# EAGLE design DeepSpace (EAGLE 9.6.2)

## Sheet 1 of 2
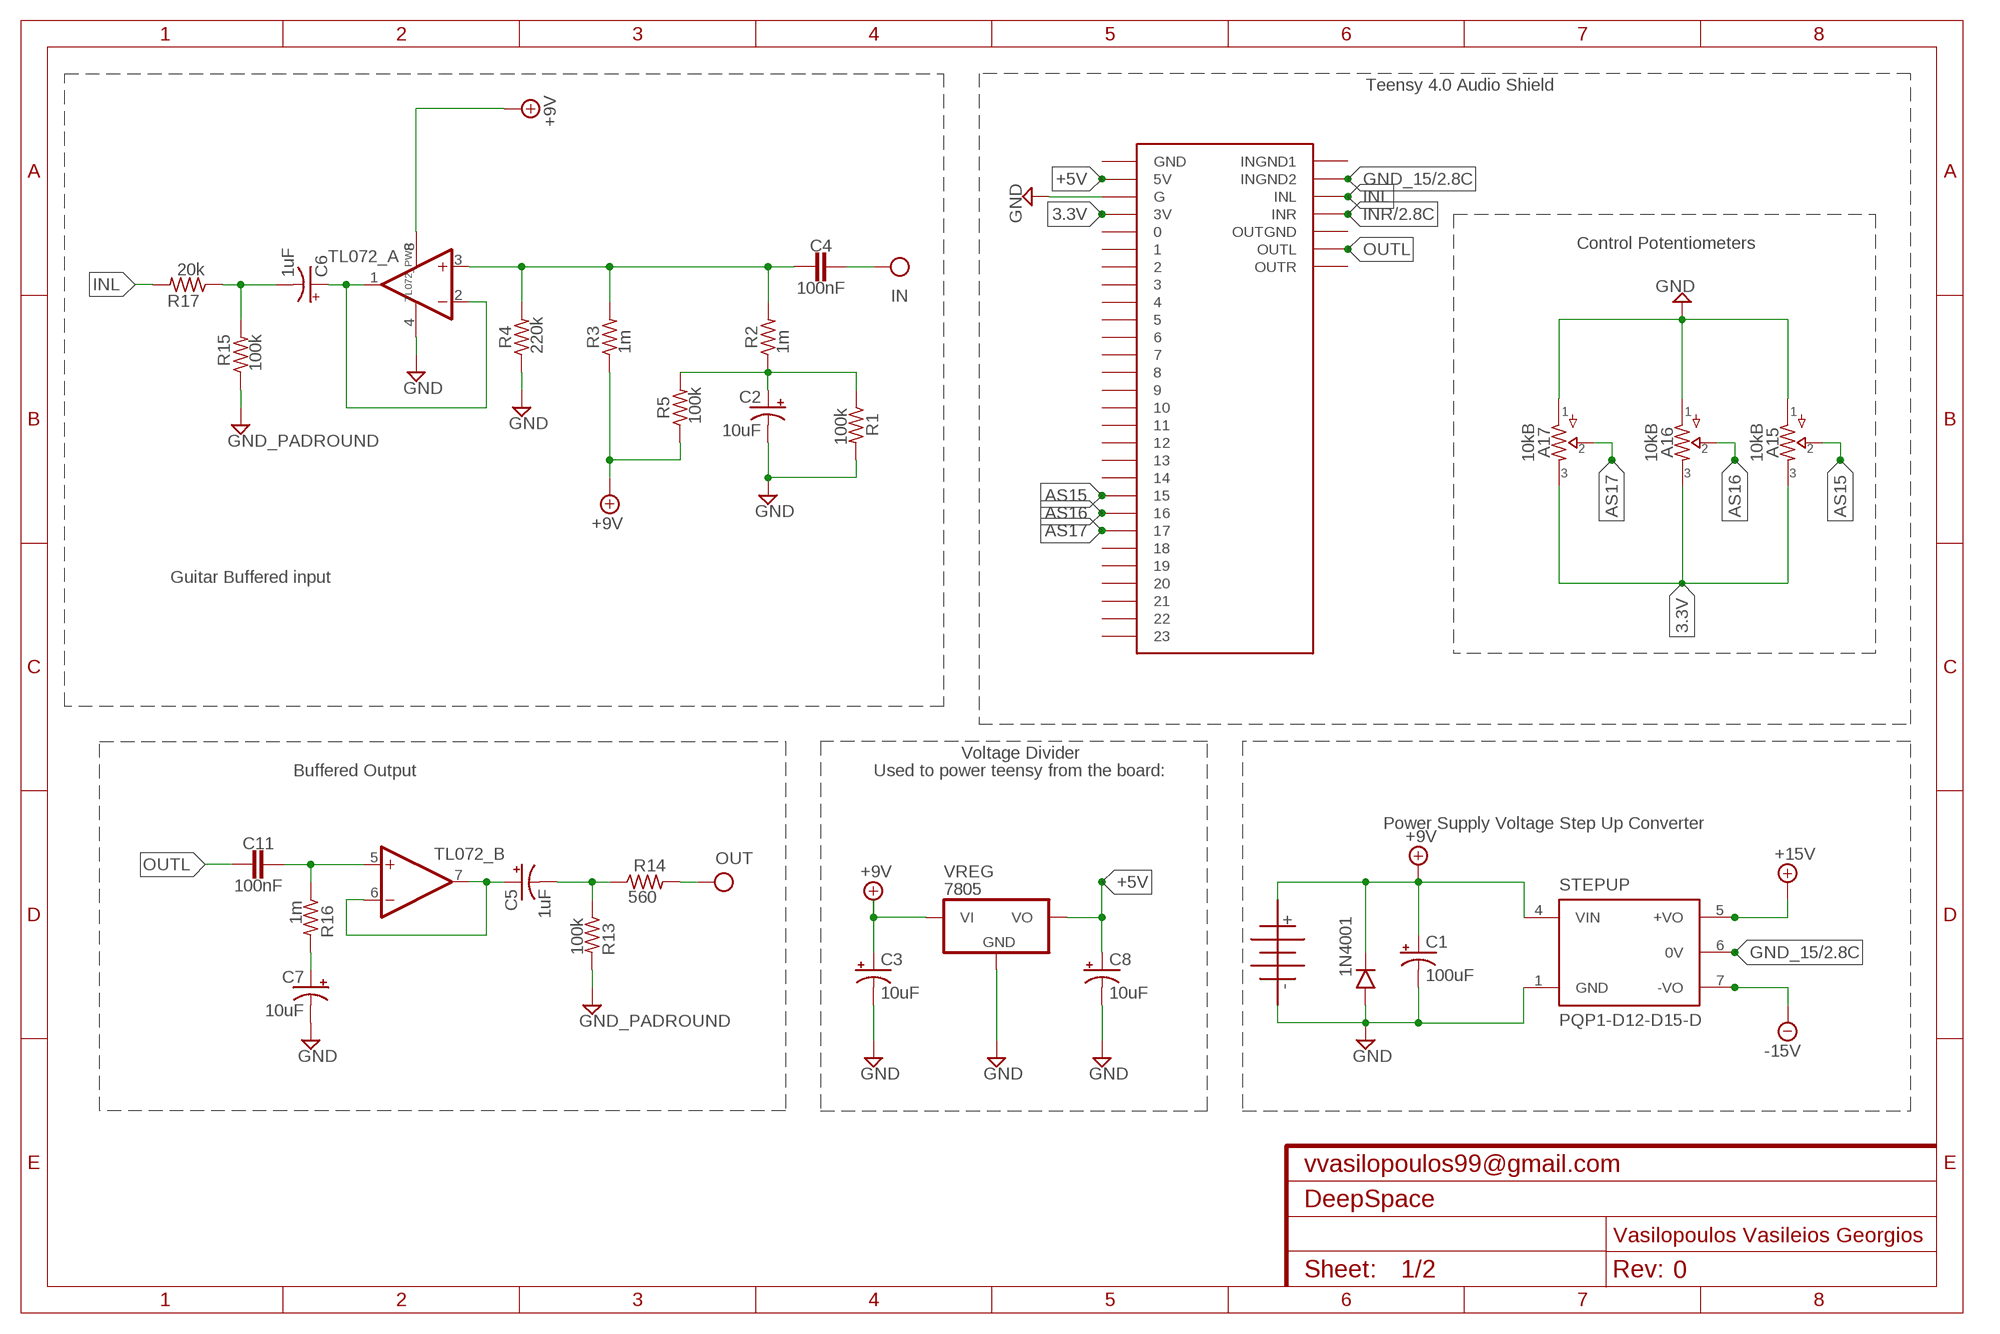
[diagram p0: schematic, sheet 1]
FRAME1 (FRAME-A4L): CNAME: vvasilopoulos99@gmail.com; CREVISION: 0; DESIGNER: Vasilopoulos Vasileios Georgios; REV: 0

### Parts
1N4001  DO41.3  [DO41-3]
A15  10kB  16MM.1  [16MM_B.MOUNT]
A16  10kB  16MM.1  [16MM_B.MOUNT]
A17  10kB  16MM.1  [16MM_B.MOUNT]
AS1  teensy audio shield  AUDIOSHIELD  [AUDIOSHIELD]
C1  100uF  0631  [063_025]
C2  10uF  0501  [050_020_1]
C3  10uF  0501  [050_020_1]
C4  100nF  CAP.2  [0.2".SML]
C5  1uF  0501  [050_020_1]
C6  1uF  0501  [050_020_1]
C7  10uF  0501  [050_020_1]
C8  10uF  0501  [050_020_1]
C11  100nF  CAP.2  [0.2".SML]
GI  GND_PADROUND  [ROUND]
GO  GND_PADROUND  [ROUND]
OUT  OUT  [SQUARE]
PWR  BATTERYBAT2  [BATTERY2]
R1  100k  RESISTORS.3B  [R0207/3]
R2  1m  RESISTORS.3B  [R0207/3]
R3  1m  RESISTORS.3B  [R0207/3]
R4  220k  RESISTORS.3B  [R0207/3]
R5  100k  RESISTORS.3B  [R0207/3]
R13  100k  RESISTORS.3B  [R0207/3]
R14  560  RESISTORS.3B  [R0207/3]
R15  100k  RESISTORS.3B  [R0207/3]
R16  1m  RESISTORS.3B  [R0207/3]
R17  20k  RESISTORS.3B  [R0207/3]
STEPUP  PQP1-D12-D15-D  [CONV_PQP1-D12-D15-D]
TL072  DUALTH  [DIL08]
VREG  7805  [TO92-]
ΙΝ  IN  [SQUARE]

### Nets
3.3V: A15.3 A16.3 A17.3 AS1.3V
10UF: C2.+ R1.1 R2.1 R5.2
+5V: AS1.5V C8.+ VREG.3(VO)
+9V: 1N4001.C C1.+ C3.+ PWR.P$1 R3.1 R5.1 STEPUP.4(VIN) TL072.8(_PWR:V+) VREG.1(VI)
+15V: STEPUP.5(+VO) ; also sheet 2
-VC: STEPUP.7(-VO) ; supply symbol labelled -15V ; also sheet 2
AS15: A15.2 AS1.15
AS16: A16.2 AS1.16
AS17: A17.2 AS1.17
GND: 1N4001.A A15.1 A16.1 A17.1 AS1.G C1.- C2.- C3.- C7.- C8.- GI.1(GND) GO.1(GND) PWR.P$2 R1.2 R4.1 R13.2 R15.1 STEPUP.1(GND) TL072.4(_PWR:V-) VREG.2(GND)
GND_15: AS1.INGND2 STEPUP.6(0V) ; also sheet 2
IN: C4.1 ΙΝ.1(IN)
INL: AS1.INL R17.2
INR: AS1.INR ; also sheet 2
N$5: C7.+ R16.2
N$9: C6.+ TL072.1(_A:OUT) TL072.2(_A:-IN)
N$10: C6.- R15.2 R17.1
N$12: C4.2 R2.2 R3.2 R4.2 TL072.3(_A:+IN)
N$14: C11.1 R16.1 TL072.5(_B:+IN)
N$15: C5.+ TL072.6(_B:-IN) TL072.7(_B:OUT)
N$23: C5.- R13.1 R14.1
OUT: OUT.1(OUT) R14.2
OUTL: AS1.OUTL C11.2
Unconnected: AS1.0 AS1.1 AS1.2 AS1.3 AS1.4 AS1.5 AS1.6 AS1.7 AS1.8 AS1.9 AS1.10 AS1.11 AS1.12 AS1.13 AS1.14 AS1.18 AS1.19 AS1.20 AS1.21 AS1.22 AS1.23 AS1.GND AS1.INGND1 AS1.OUTGND AS1.OUTR

### Notes on the sheet
- Teensy 4.0 Audio Shield
- Control Potentiometers
- Guitar Buffered input
- Voltage Divider
- Buffered Output | Used to power teensy from the board:
- Power Supply Voltage Step Up Converter

## Sheet 2 of 2
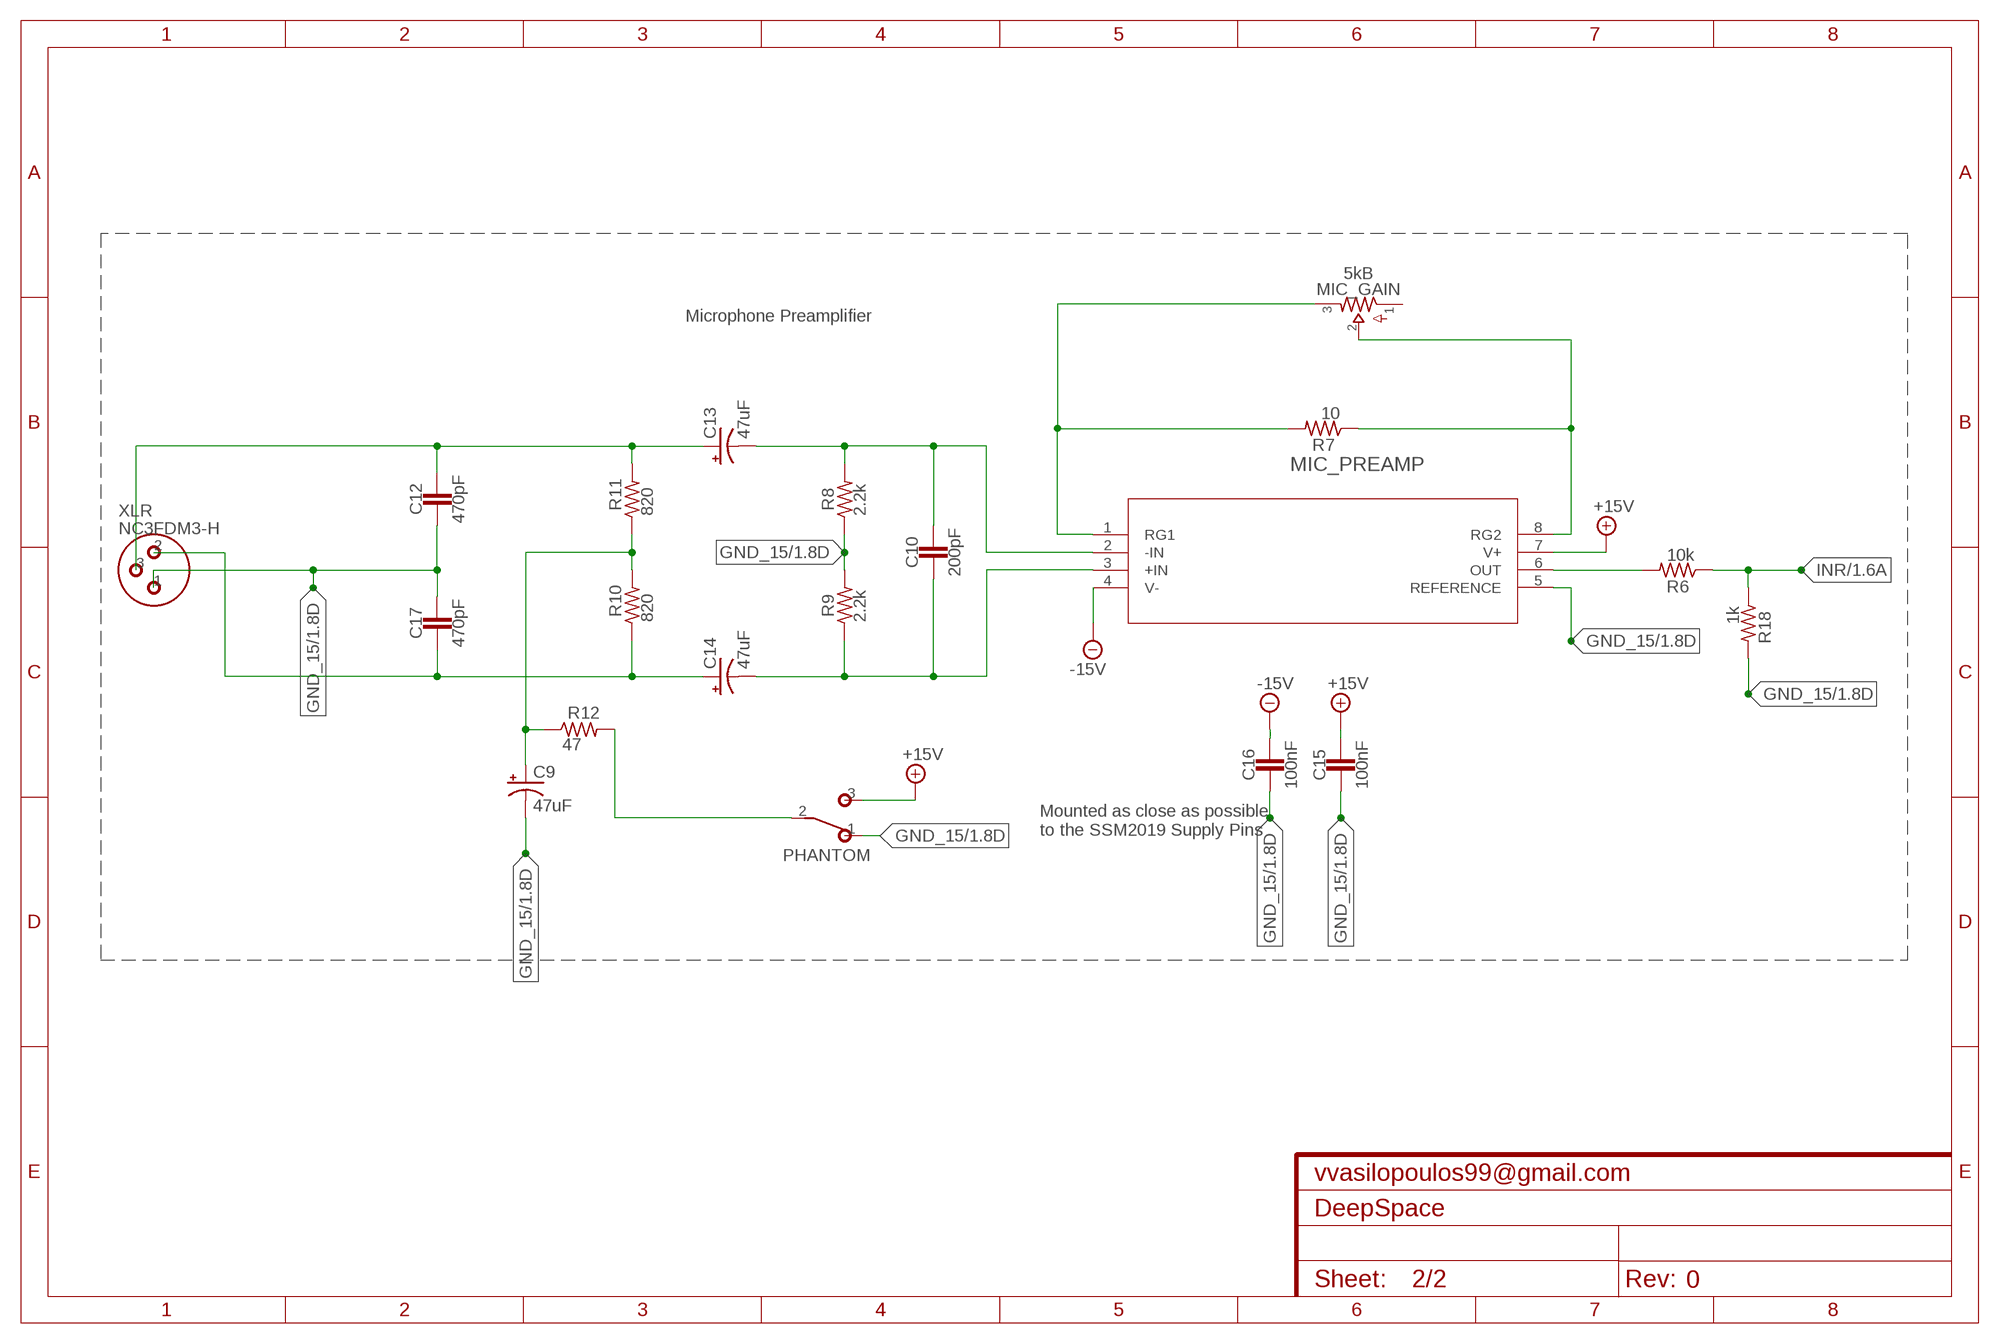
[diagram p1: schematic, sheet 2]
FRAME2 (FRAME-A4L): CNAME: vvasilopoulos99@gmail.com; CREVISION: 0

### Parts
C9  47uF  0501  [050_020_1]
C10  200pF  CAP.2  [0.2".SML]
C12  470pF  CAP.2  [0.2".SML]
C13  47uF  0631  [063_025]
C14  47uF  0631  [063_025]
C15  100nF  CAP.2  [0.2".SML]
C16  100nF  CAP.2  [0.2".SML]
C17  470pF  CAP.2  [0.2".SML]
MIC_GAIN  5kB  TRIMMER  [TRIM1]
MIC_PREAMP  SSM2019BNZ  [N_8_ADI]
PHANTOM  SPDTPADS  [SPDT]
R6  10k  RESISTORS.3B  [R0207/3]
R7  10  RESISTORS.3B  [R0207/3]
R8  2.2k  RESISTORS.3B  [R0207/3]
R9  2.2k  RESISTORS.3B  [R0207/3]
R10  820  RESISTORS.3B  [R0207/3]
R11  820  RESISTORS.3B  [R0207/3]
R12  47  RESISTORS.3B  [R0207/3]
R18  1k  RESISTORS.3B  [R0207/3]
XLR  NC3FDM3-H  XLR  [XLR_PADS]

### Nets
+15V: C15.1 MIC_PREAMP.7(V+) PHANTOM.3(S) ; also sheet 1
-VC: C16.1 MIC_PREAMP.4(V-) ; supply symbol labelled -15V ; also sheet 1
GND_15: C9.- C12.2 C15.2 C16.2 C17.1 MIC_PREAMP.5(REFERENCE) PHANTOM.1(O) R8.1 R9.2 R18.2 XLR.1 ; also sheet 1
INR: R6.1 R18.1 ; also sheet 1
N$1: MIC_GAIN.3 MIC_PREAMP.1(RG1) R7.2
N$2: MIC_GAIN.2 MIC_PREAMP.8(RG2) R7.1
N$3: C10.1 C13.- MIC_PREAMP.2(-IN) R8.2
N$4: C10.2 C14.- MIC_PREAMP.3(+IN) R9.1
N$7: C9.+ R10.2 R11.1 R12.1
N$8: PHANTOM.2(P) R12.2
N$20: MIC_PREAMP.6(OUT) R6.2
XLR2: C12.1 C13.+ R11.2 XLR.3
XLR2-SSM3: C14.+ C17.2 R10.1 XLR.2
Unconnected: MIC_GAIN.1

### Notes on the sheet
- Microphone Preamplifier
- Mounted as close as possible 
  to the SSM2019 Supply Pins

## Library data of the parts
1N4001 = diodes:DO41: DO-41 Package Diodes: 1N4001 - 1N40019 Zener Diodes: 1N4728 - 1N4764
A15-A17 = potentiometers:16MM: 16mm Poteniometers
AS1 = Teensy_Audioshield_no_holes:AUDIOSHIELD: Teensy 3 Audioshield by PJRC.COM; MF: ADAFRUIT; MPN: 4384; OC_NEWARK: 50AH1487
C1 C13 C14 = caps-elec:063: 33 - 220uF Xicon values at Mouser.com 10V: 220uF; 16V: 100uF; 25V: 100uF; 50V: 33uF
C2 C3 C5-C9 = caps-elec:050: 0.22 - 100uF Xicon values at Mouser.com: 10V: 10 - 100uF; 16V: 2.2 - 47uF; 25V: 0.47 - 47uF; 50V: 0.22 - 22uF
C4 C10-C12 C15-C17 = caps-film:CAP: For Ceramic, Film, MLCC caps
GI GO = supply pins:GND_PAD: Ground use this to hook up ground connections throughout a schematic instead of running wire automatically labels the net "GND"
MIC_GAIN = potentiometers:TRIMMER: Trimpots
MIC_PREAMP = Ssm2019:SSM2019BNZ; BUILT_BY: EMA_UL_Team; MANUFACTURER_PART_NUMBER: SSM2019BNZ; MF: ANALOG DEVICES; MPN: SSM2019BRNZ; OC_NEWARK: 94T5936; SOURCELIBRARY: Analog_2012-01-01_9; VENDOR: Analog Devices Inc
OUT = supply pins:OUT: Output obsolete: use Mark instead and label net output label without circuit board terminal/pad commonly used as output label on 2nd lug of a potentiometer
PHANTOM = switches:SPDT: TOGGLE SWITCH Marquardt
PWR = jacks:BATTERY
R1-R18 = resistors:RESISTORS
STEPUP = PQP1-D12-D15-D:PQP1-D12-D15-D: DC-DC CONVERTER; MANUFACTURER: CUI Inc.; MAXIMUM_PACKAGE_HEIGHT: 9.50mm; OC_NEWARK: unknown; PARTREV: 1.0; STANDARD: Manufacturer Recommendations
TL072 = integrated circuits:DUAL: OP AMP
VREG = regulators:7805
XLR = jacks:XLR
ΙΝ = supply pins:IN: Input obsolete: use Mark instead and label net schematic input label without circuit board terminal/pad labels net "IN" provided as complement to OUT (rarely used)

## Net classes
0 default: width 0.254 mm, drill 0.508 mm, clearance 0.254 mm

## Board
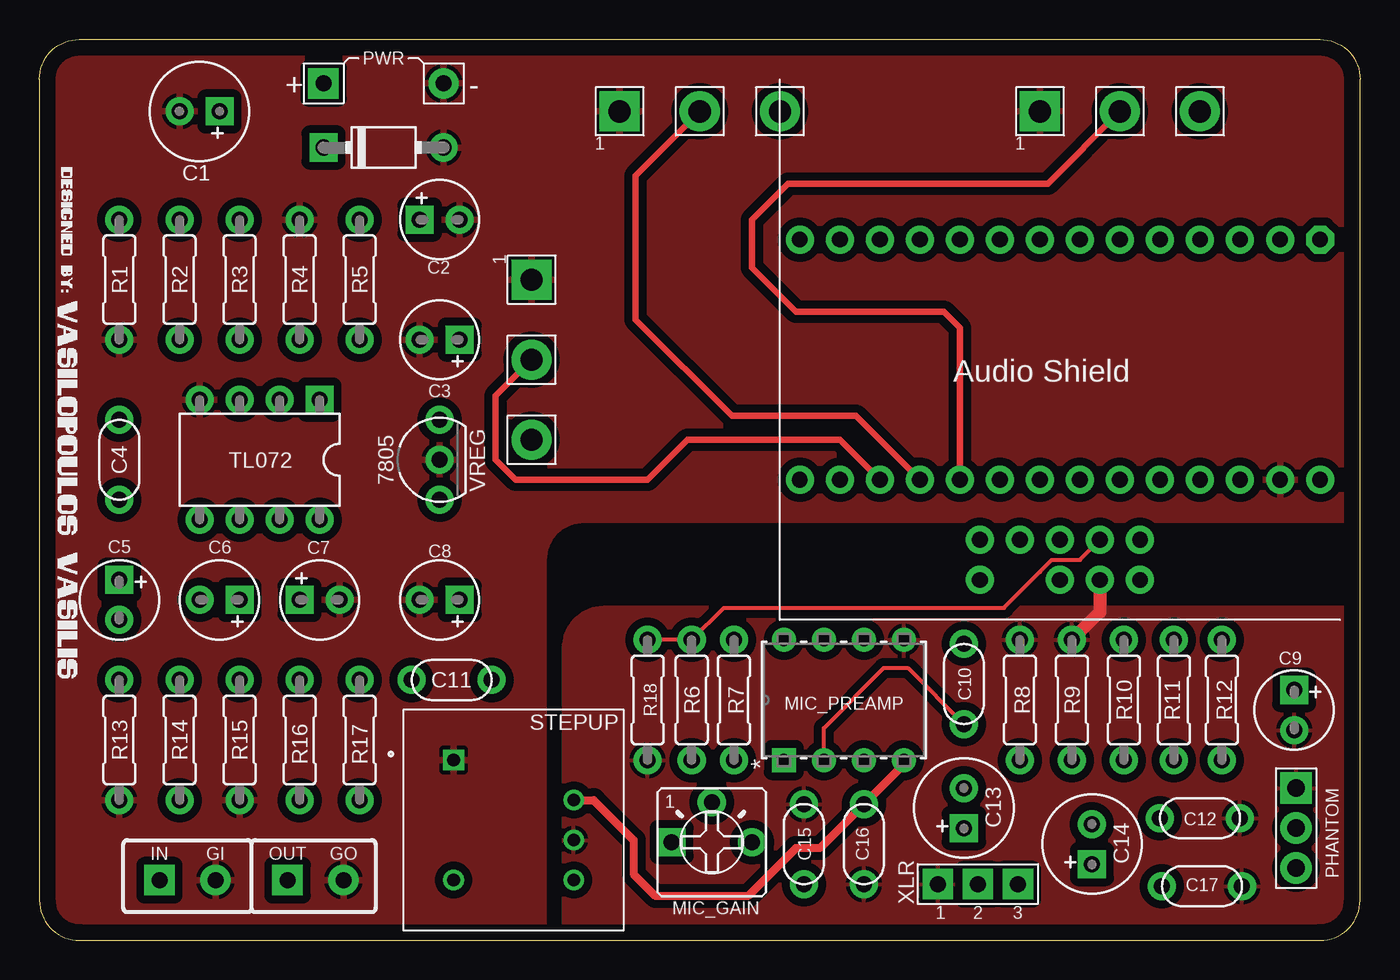
[diagram p2: board, top side]
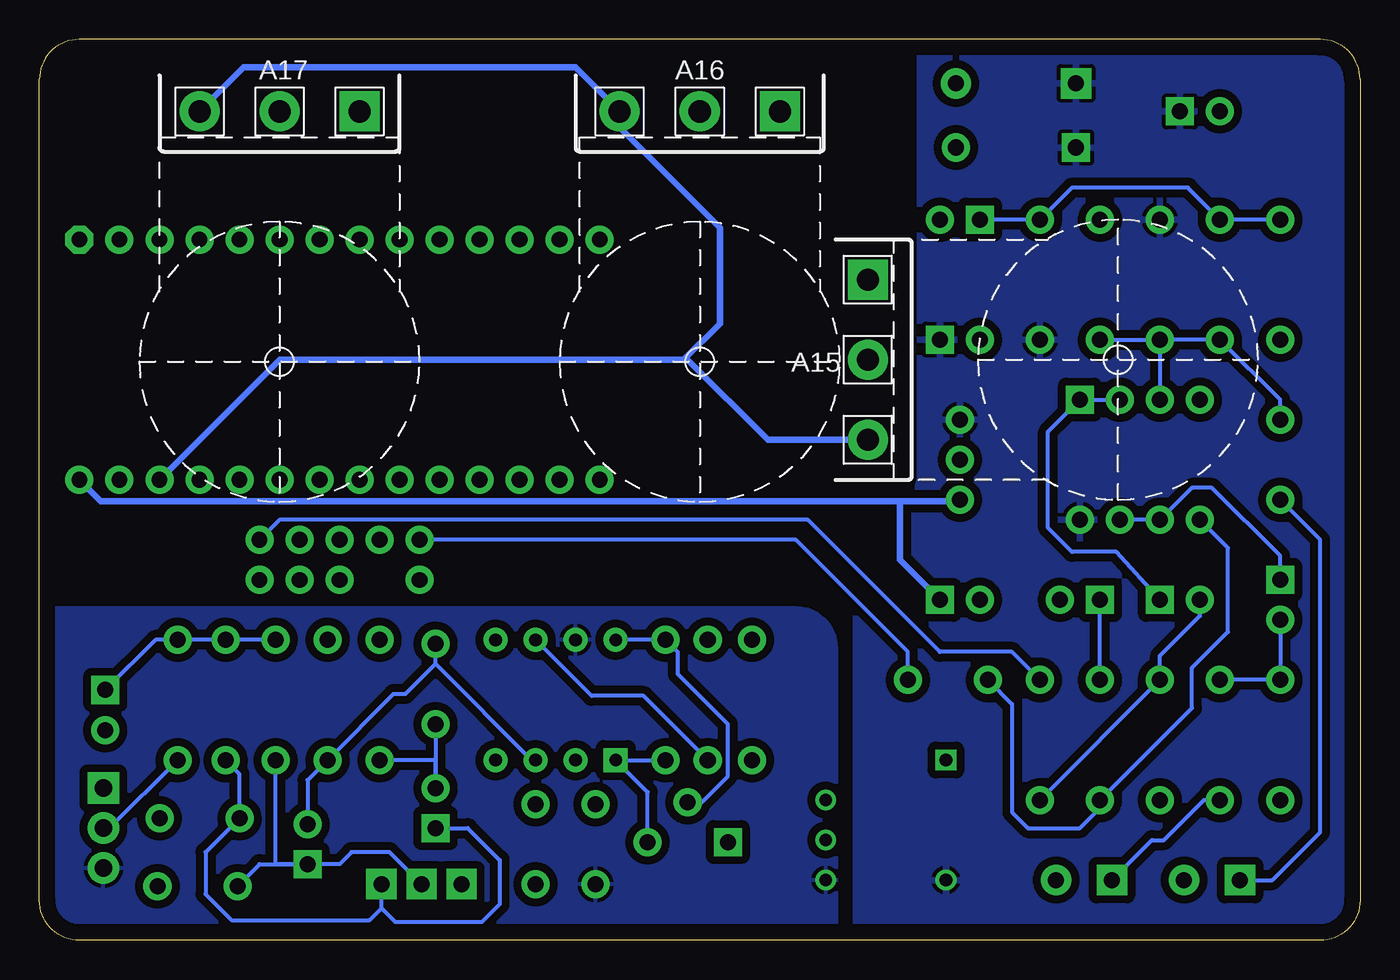
[diagram p3: board, bottom side, seen from below]

Size 83.82 x 57.15 mm. Coordinates in mm from the lower left corner, seen from the top.
Outline: 0,2.54 arc90 2.54,0 81.28,0 arc90 83.82,2.54 83.82,54.61 arc90 81.28,57.15 2.54,57.15 arc90 0,54.61 0,2.54
Copper layers (1*16): Top 0.035mm / dielectric 1.5mm / Bottom 0.035mm
Design rules "default *": minimum track width 10mil, minimum drill 0.35mm, track to track 20mil, track to pad 10mil, pad to pad 10mil, via to via 10mil, smd to smd 6mil, copper to edge 40mil, drill to drill 6mil, minimum pad ring 10mil, minimum via ring 8mil, stop-mask expansion 4mil, vias tented up to drill 0mil, thermal gap 10mil

### Footprints (pad centres in the part's own frame; a part is rotated, then mirrored left to right if it is on the bottom)
DO41-3 = drill 1.016 pad 1.778: A 3.81,0 | drill 1.016 pad 1.778 square: C -3.81,0
16MM_B.MOUNT = drill 1.4 pad 2.54 square: 1 5.08,0 | drill 1.4 pad 2.54: 2 0,0; 3 -5.08,0
AUDIOSHIELD = drill 1 pad 1.778: 0 -13.97,-5.08; 1 -11.43,-5.08; 2 -8.89,-5.08; 3 -6.35,-5.08; 3V -11.43,10.16; 4 -3.81,-5.08; 5 -1.27,-5.08; 5V -16.51,10.16; 6 1.27,-5.08; 7 3.81,-5.08; 8 6.35,-5.08; 9 8.89,-5.08; 10 11.43,-5.08; 11 13.97,-5.08; 12 16.51,-5.08; 13 16.51,10.16; 14 13.97,10.16; 15 11.43,10.16; 16 8.89,10.16; 17 6.35,10.16; 18 3.81,10.16; 19 1.27,10.16; 20 -1.27,10.16; 21 -3.81,10.16; 22 -6.35,10.16; 23 -8.89,10.16; G -13.97,10.16; INGND1 -5.08,16.51; INGND2 -2.54,16.51; INL -5.08,13.97; INR -2.54,13.97; OUTGND 2.54,13.97; OUTL 5.08,13.97; OUTR 0,13.97; UNUSED1 0,16.51; UNUSED2 5.08,16.51 | drill 1 pad 1.778 octagon: GND -16.51,-5.08
063_025 = drill 1.016 pad 1.778 square: + -1.27,0 | drill 1.016 pad 1.778: - 1.27,0
050_020_1 = drill 1.016 pad 1.778 square: + -1.27,0 | drill 1.016 pad 1.778: - 1.27,0
0.2".SML = drill 1.016 pad 1.778: 1 -2.54,0; 2 2.54,0
ROUND = drill 1.016 pad 1.93: 1 0,0
TRIM1 = drill 1.016 pad 1.778 square: 1 -2.54,0 | drill 1.016 pad 1.778: 2 0,2.54; 3 2.54,0
N_8_ADI = drill 0.813 pad 1.524 square: 1 0,0 | drill 0.813 pad 1.524: 2 0,-2.54; 3 0,-5.08; 4 0,-7.62; 5 7.62,-7.62; 6 7.62,-5.08; 7 7.62,-2.54; 8 7.62,0
SQUARE = drill 1.016 pad 1.93 square: 1 0,0
SPDT = drill 1.118 pad 2 square: 1 -2.54,0 | drill 1.118 pad 2: 2 0,0; 3 2.54,0
BATTERY2 = drill 1.016 pad 1.93 square: P$1 -3.81,0 | drill 1.016 pad 1.93: P$2 3.81,0
R0207/3 = drill 1.016 pad 1.778: 1 -3.81,0; 2 3.81,0
CONV_PQP1-D12-D15-D = drill 0.8 square: 1 -3.81,3.81 | drill 0.8: 4 -3.81,-3.81; 5 3.81,-3.81; 6 3.81,-1.27; 7 3.81,1.27
DIL08 = drill 1.016 pad 1.778 square: 1 -3.81,-3.81 | drill 1.016 pad 1.778: 2 -1.27,-3.81; 3 1.27,-3.81; 4 3.81,-3.81; 5 3.81,3.81; 6 1.27,3.81; 7 -1.27,3.81; 8 -3.81,3.81
TO92- = drill 1.016 pad 1.778: 1 -2.54,0; 2 0,0; 3 2.54,0
XLR_PADS = drill 1.016 pad 1.93 square: 1 -2.54,0; 2 0,0; 3 2.54,0

### Placement (x,y rotation side)
1N4001  21.84,50.29 0 top
A15  31.24,36.83 90 top
A16  41.91,52.58 180 top
A17  68.58,52.58 180 top
AS1  64.77,39.37 180 top
C1  10.16,52.58 180 top
C2  25.4,45.72 0 top
C3  25.4,38.1 180 top
C4  5.08,30.48 90 top
C5  5.08,21.59 270 top
C6  11.43,21.59 180 top
C7  17.78,21.59 0 top
C8  25.4,21.59 180 top
C9  79.63,14.61 270 top
C10  58.67,16.26 90 top
C11  26.16,16.51 0 top
C12  73.66,7.75 0 top
C13  58.67,8.38 90 top
C14  66.8,6.1 90 top
C15  48.51,6.1 90 top
C16  52.32,6.1 270 top
C17  73.79,3.43 180 top
GI  11.18,3.81 0 top
GO  19.3,3.81 0 top
MIC_GAIN  42.67,6.22 0 top
MIC_PREAMP  47.24,11.43 90 top
OUT  15.75,3.81 0 top
PHANTOM  79.76,7.11 270 top
PWR  21.84,54.36 0 top
R1  5.08,41.91 270 top
R2  8.89,41.91 270 top
R3  12.7,41.91 270 top
R4  16.51,41.91 270 top
R5  20.32,41.91 90 top
R6  41.4,15.24 270 top
R7  44.07,15.24 270 top
R8  62.23,15.24 270 top
R9  65.53,15.24 90 top
R10  68.83,15.24 90 top
R11  72.01,15.24 270 top
R12  75.06,15.24 270 top
R13  5.08,12.7 270 top
R14  8.89,12.7 270 top
R15  12.7,12.7 90 top
R16  16.51,12.7 90 top
R17  20.32,12.7 90 top
R18  38.61,15.24 270 top
STEPUP  30.1,7.62 0 top
TL072  13.97,30.48 180 top
VREG  25.4,30.48 270 top
XLR  59.56,3.56 0 top
ΙΝ  7.62,3.81 0 top

### Tracks (layer width: path | path; a pad name or v marks a point on that pad's centre or on a via)
3.3V
  Bottom 0.406: 42.93,36.83 40.64,39.12 40.64,45.21 46.99,51.56 A16.3 49.78,55.37 70.87,55.37 A17.3 | AS1.3V 68.58,36.83 42.93,36.83 | A15.3 37.59,31.75 42.67,36.83 42.93,36.83
10UF
  Bottom 0.254: R1.1 R2.1 10.92,47.75 18.29,47.75 R5.2 C2.+
+5V
  Bottom 0.406: 29.21,27.86 79.93,27.86 AS1.5V | 29.21,27.86 25.48,27.86 VREG.3 | C8.+ 29.21,24.13 29.21,27.86
+9V
  pour Bottom (isolate 0.508): 0,54.61 0,2.54 arc90 2.54,0 32,0 32,25.4 arc90 29.46,27.94 arc-90 27.94,29.46 27.94,57.15 2.54,57.15 arc90
+15V
  pour Bottom: 33.27,18.54 33.27,0 83.82,0 83.82,21.08 35.81,21.08 arc90
-VC
  Top 0.508: MIC_PREAMP.4 54.86,11.18 C16.1 49.53,5.84 48.01,5.84 44.96,2.79 39.12,2.79 37.72,4.19 37.72,6.35 35.18,8.89 STEPUP.7
AS15
  Top 0.406: AS1.15 50.8,31.75 41.15,31.75 38.61,29.21 30.23,29.21 28.96,30.48 28.96,34.54 A15.2
AS16
  Top 0.406: AS1.16 51.82,33.27 43.94,33.27 37.85,39.37 37.85,48.51 A16.2
AS17
  Top 0.406: A17.2 64.01,48.01 47.5,48.01 45.21,45.72 45.21,42.67 48.01,39.88 57.4,39.88 58.42,38.86 AS1.17
GND
  pour Top (isolate 0.508): 0,54.61 0,2.54 arc90 2.54,0 32,0 32,24.13 arc-90 34.54,26.67 83.82,26.67 83.82,54.61 arc90 81.28,57.15 2.54,57.15 arc90
GND_15
  Top 0.813: AS1.INGND2 67.31,20.83 R9.2
  pour Top: 33.27,18.54 33.27,0 83.82,0 83.82,21.08 35.81,21.08 arc90
IN
  Bottom 0.254: ΙΝ.1 5.59,3.81 2.54,6.86 2.54,25.4 C4.1
INL
  Bottom 0.254: R17.2 22.1,18.29 26.67,18.29 35.05,26.67 68.58,26.67 AS1.INL
INR
  Top 0.254: AS1.INR 66.04,24.13 64.24,24.13 63.5,23.39 63.5,23.37 61.21,21.08 43.43,21.08 R6.1 R18.1
N$1
  Bottom 0.254: MIC_GAIN.3 45.21,9.4 MIC_PREAMP.1 R7.2
N$2
  Bottom 0.254: MIC_PREAMP.8 R7.1 43.31,18.29 43.31,16.89 40.13,13.72 40.13,10.41 41.78,8.76 MIC_GAIN.2
N$3
  Top 0.254: MIC_PREAMP.2 49.78,13.46 53.59,17.27 55.12,17.27 C10.1
  Bottom 0.254: C10.1 C13.- 58.67,11.43 R8.2
N$4
  Bottom 0.254: 58.67,17.53 C10.2 | 58.67,17.53 52.58,11.43 MIC_PREAMP.3 | 58.67,17.53 60.58,15.62 61.34,15.62 R9.1 66.8,10.16 C14.-
N$5
  Bottom 0.254: R16.2 C7.+
N$7
  Bottom 0.254: R10.2 R11.1 R12.1 76.45,19.05 C9.+
N$8
  Bottom 0.254: PHANTOM.2 79.38,7.11 R12.2
N$9
  Bottom 0.254: C6.+ 15.48,24.64 18.29,24.64 19.81,26.16 19.81,32.26 TL072.1 TL072.2
N$10
  Bottom 0.254: C6.- 10.16,20.57 12.7,18.03 R15.2 R17.1
N$12
  Bottom 0.254: C4.2 5.08,34.29 R2.2 R3.2 | R3.2 TL072.3 | R4.2 R3.2
N$14
  Bottom 0.254: C11.1 22.1,14.99 22.1,8.13 21.08,7.11 17.78,7.11 16.51,8.38 R16.1 10.67,14.73 10.67,17.27 8.38,19.56 8.38,24.89 TL072.5
N$15
  Bottom 0.254: C5.+ 5.08,24.38 9.4,28.7 10.67,28.7 TL072.6 TL072.7
N$20
  Bottom 0.254: R6.2 45.47,15.49 48.77,15.49 MIC_PREAMP.6
N$23
  Bottom 0.254: C5.- R13.1 R14.1
OUT
  Bottom 0.254: OUT.1 13.21,6.35 12.45,6.35 9.91,8.89 R14.2
OUTL
  Bottom 0.254: C11.2 28.7,18.29 35.81,25.4 AS1.OUTL
XLR2
  Bottom 0.254: C13.+ 56.64,7.11 54.61,5.08 54.61,2.29 55.75,1.14 61.21,1.14 62.1,2.03 | 62.1,2.03 XLR.3 | R11.2 71.12,10.54 C12.1 73.28,5.59 73.28,2.92 71.63,1.27 62.87,1.27 62.1,2.03
XLR2-SSM3
  Bottom 0.254: XLR.2 61.59,5.59 64.01,5.59 64.77,4.83 C14.+ | C14.+ 69.85,4.83 C17.2 | C14.+ 68.83,4.83 R10.1